# Altium schematic sheet connectors.SchDoc
size A
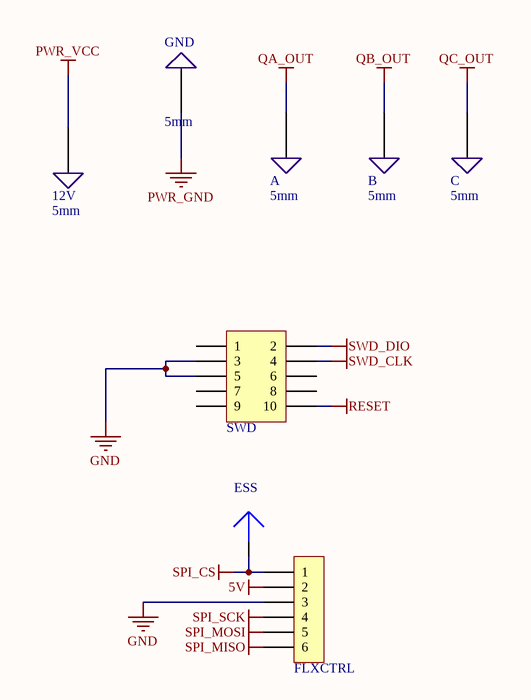
[diagram p0: connectors.SchDoc]

## Parts
12V  5mm  [SQUARE_PAD_5mm]  (no BOM)
A  5mm  [SQUARE_PAD_5mm]  (no BOM)
B  5mm  [SQUARE_PAD_5mm]  (no BOM)
C  5mm  [SQUARE_PAD_5mm]  (no BOM)
ESS  TESTPOINT-ARROW-BLUE  [TESTP_PAD_.75mm]  (value not drawn)
FLXCTRL  HEADER-6x1  [X-JST-S6B-ZR]  (value not drawn)
GND  5mm  [SQUARE_PAD_5mm]  (no BOM)
SWD  HEADER-5x2S  [G-HEADER_5x2I.05P_SM]  (value not drawn)

## Nets
5V: FLXCTRL.2
GND: FLXCTRL.3 SWD.3 SWD.5
PWR_GND: GND.1(Wire)
PWR_VCC: 12V.1(Wire)
QA_OUT: A.1(Wire)
QB_OUT: B.1(Wire)
QC_OUT: C.1(Wire)
RESET: SWD.10
SPI_CS: ESS.1 FLXCTRL.1
SPI_MISO: FLXCTRL.6
SPI_MOSI: FLXCTRL.5
SPI_SCK: FLXCTRL.4
SWD_CLK: SWD.4
SWD_DIO: SWD.2

Not connected (* = marked no-connect by the designer): SWD 1 6 7 8 9

## Library data of the parts
12V A B C GND = SOLDER_WIRE_5x5: Pad to solder wire; Name: SOLDER_WIRE_5x5; Value: 5mm
ESS = TESTP_PAD_.75mm: Round Test Point on Board; Value: 0.75mm; Name: TESTP_PAD_.75mm
FLXCTRL = HEADER_6x1_1.5mm_ZH_TH: CONN HEADER ZH SIDE 6POS 1.5MM; Manufacturer: JST Sales America Inc; Manufacturer Part Number: S6B-ZR(LF)(SN); Name: HEADER_6x1_1.5mm_ZH_TH; Supplier 1: Digi-Key; Supplier Part Number 1: 455-1673-ND
SWD = HEADER_5x2_50mil_U: CONN HEADER 10POS DL UNSHRD SMD; Name: HEADER_5x2_50mil_U